# EAGLE design omnibus_proto (EAGLE 6.6.0)

## Sheet 1 of 2
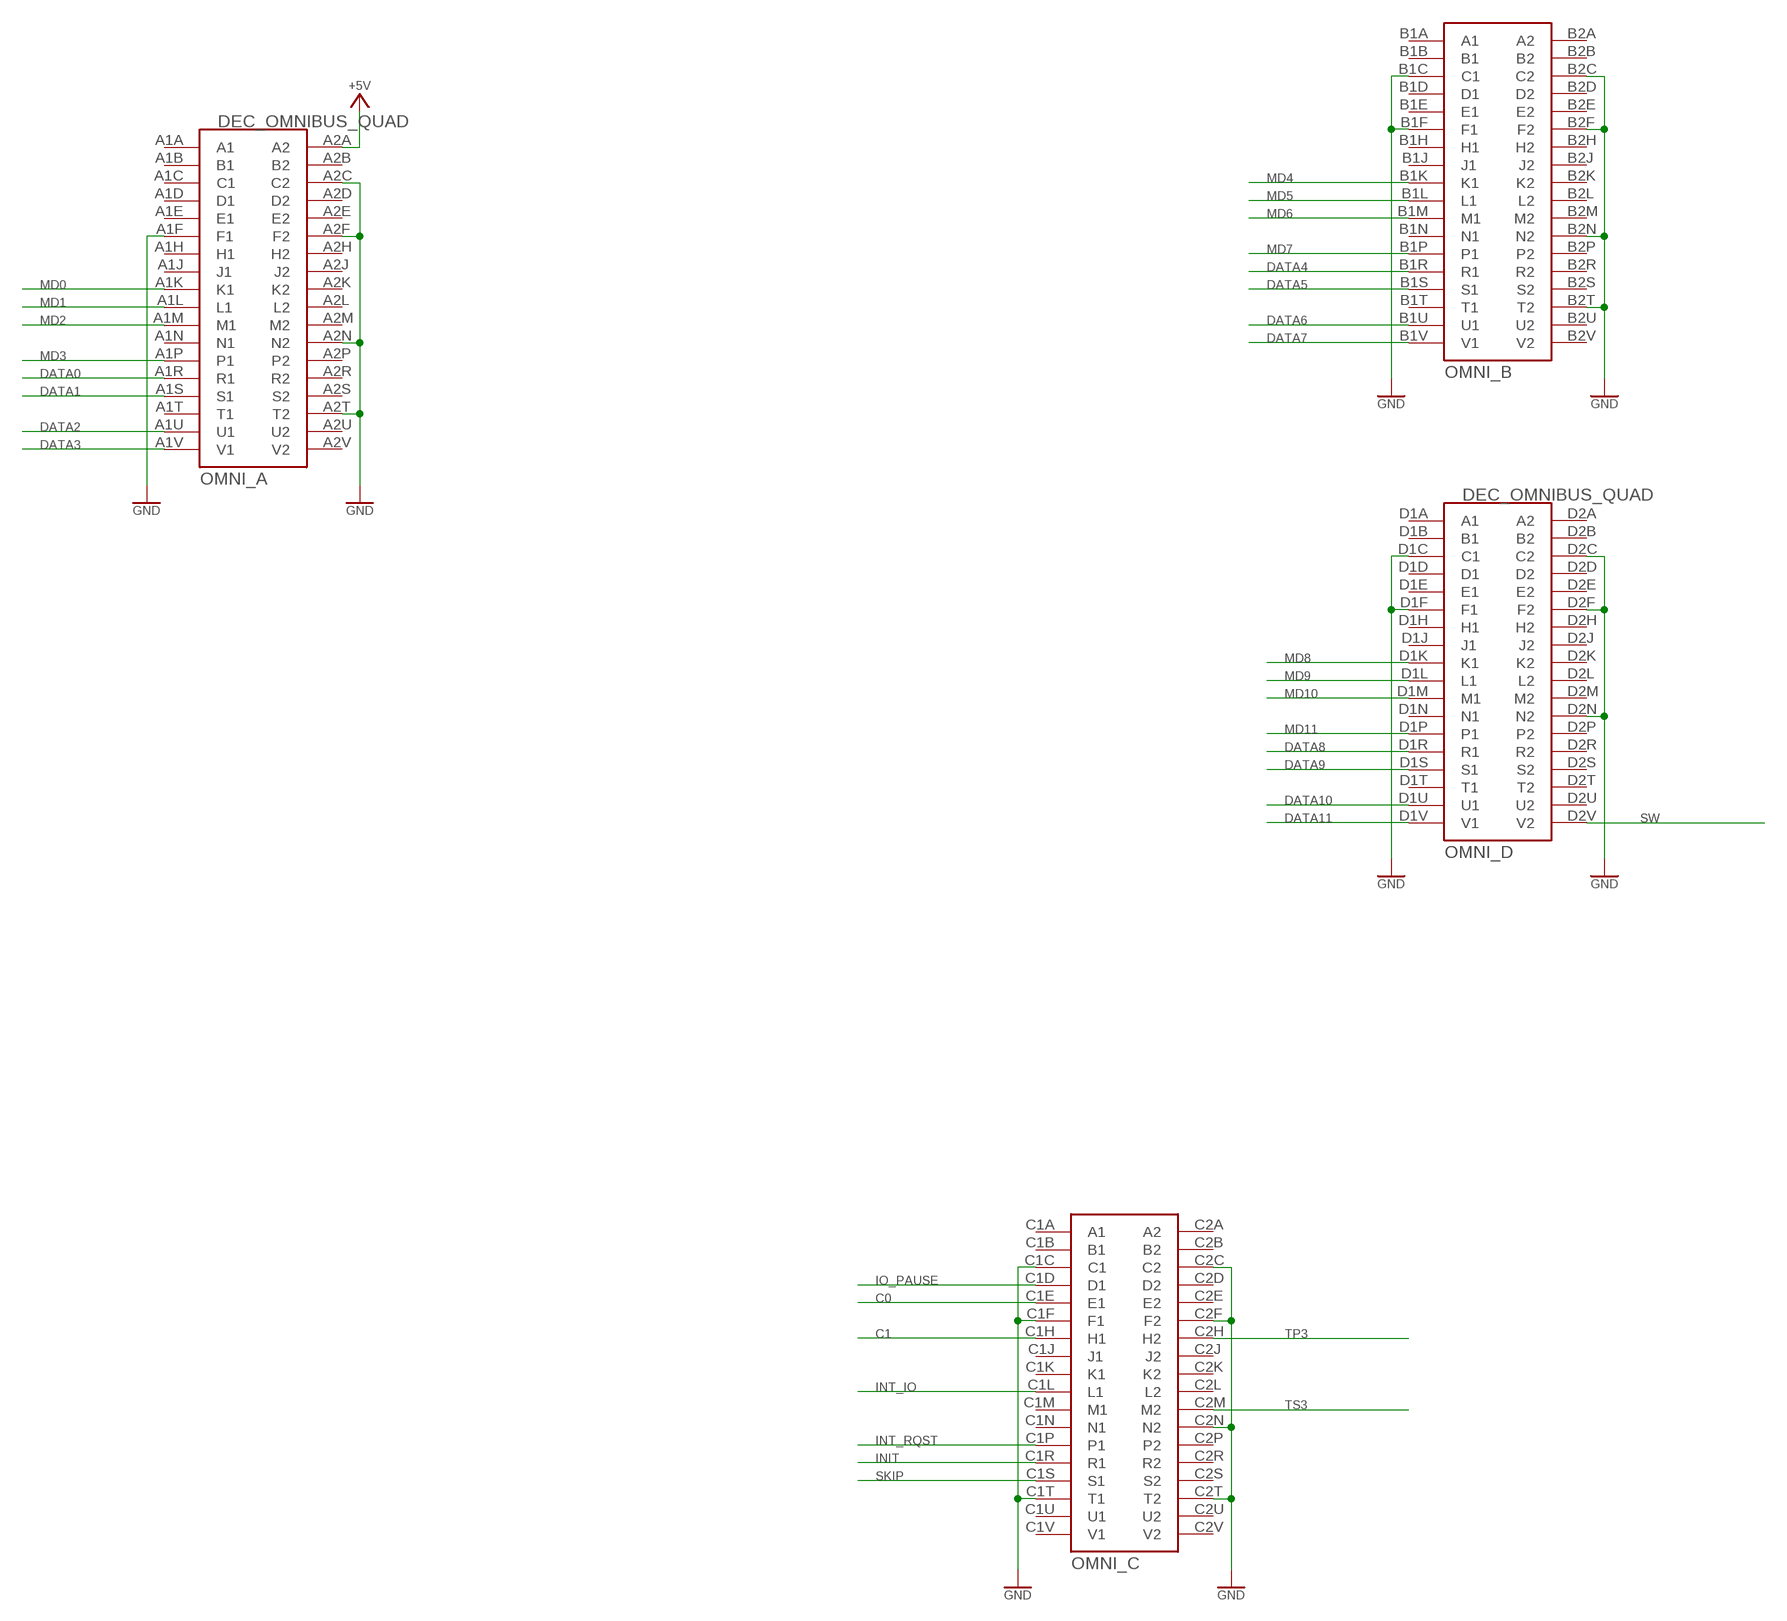
[diagram p0: schematic, sheet 1, part 1 of 2]
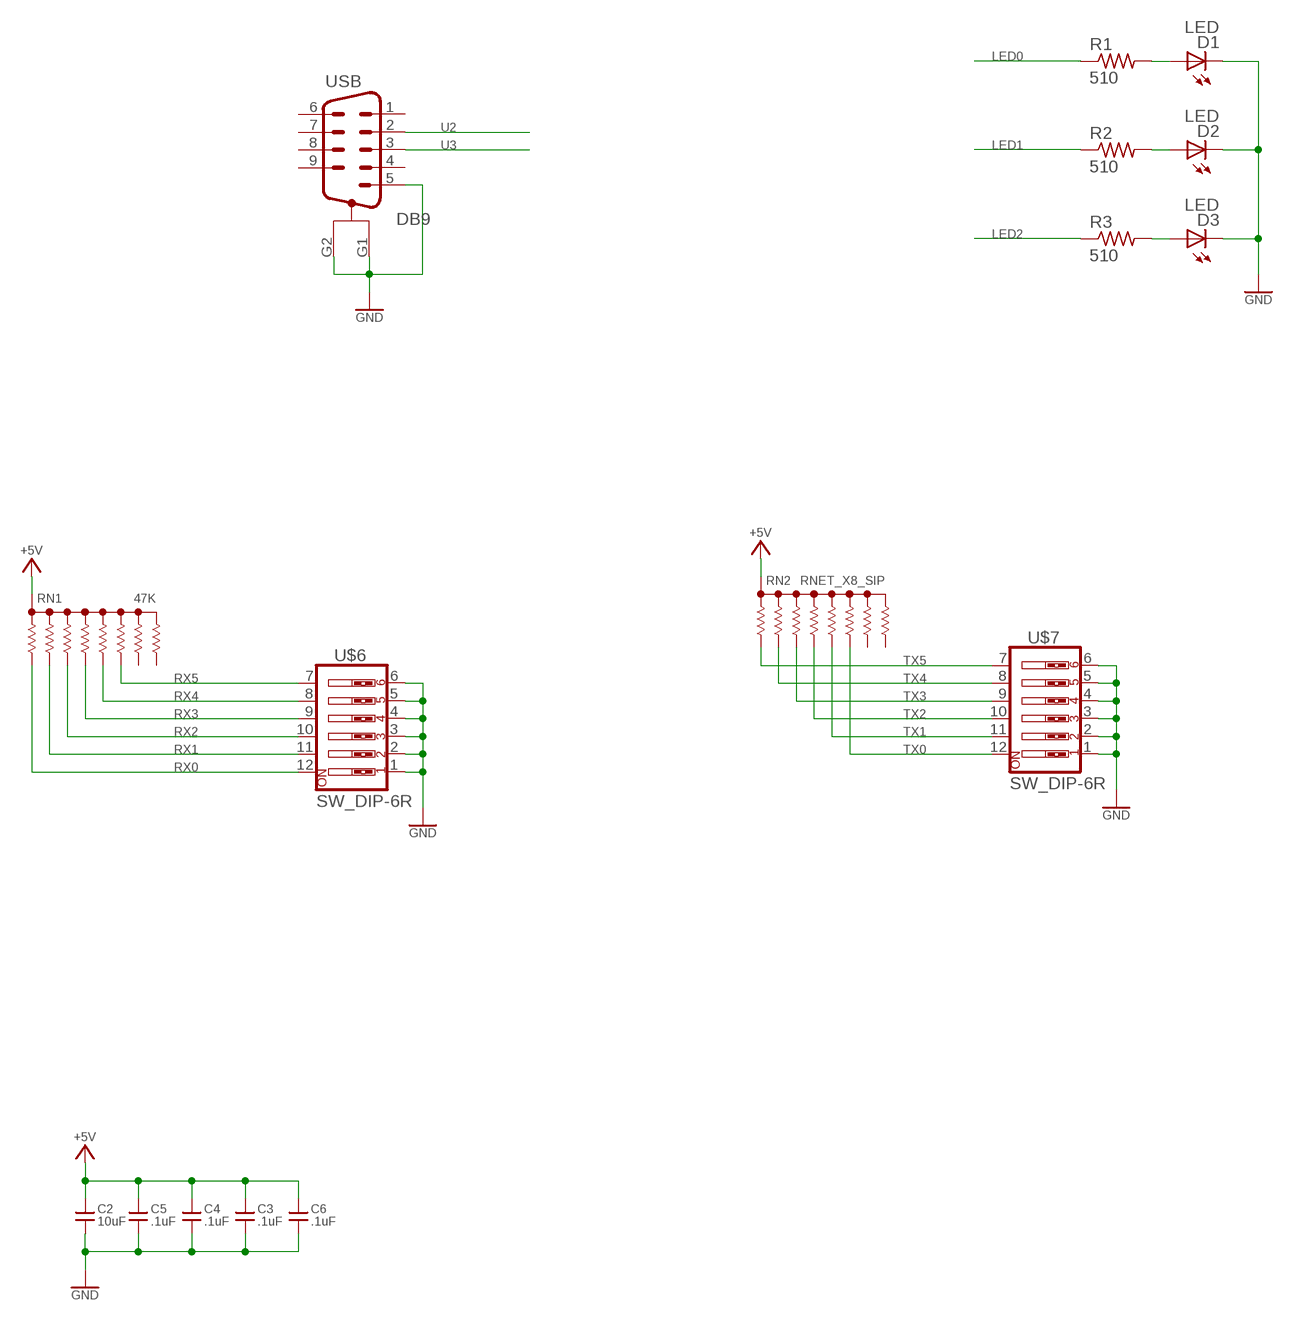
[diagram p1: schematic, sheet 1, part 2 of 2]

### Parts
C2  10uF  C_US  [C_TH_5MM]
C3  .1uF  C_US  [C_TH_5MM]
C4  .1uF  C_US  [C_TH_5MM]
C5  .1uF  C_US  [C_TH_5MM]
C6  .1uF  C_US  [C_TH_5MM]
D1  LED  [LED_TH_3MM]
D2  LED  [LED_TH_3MM]
D3  LED  [LED_TH_3MM]
OMNI  DEC_OMNIBUS_QUAD  [DEC_OMNIBUS_QUAD]
R1  510  R_US  [R_204/7]
R2  510  R_US  [R_204/7]
R3  510  R_US  [R_204/7]
RN1  47K  RNET_X8_SIP  [RN_SIP9]
RN2  RNET_X8_SIP  [RN_SIP9]
U$6  SW_DIP-6R  [SW_DIP-6_ROUND]
U$7  SW_DIP-6R  [SW_DIP-6_ROUND]
USB  DB9  [AMP_DB-9RA]

### Nets
+5V: C2.1 C3.1 C4.1 C5.1 C6.1 OMNI.A2A(_A:A2) RN1.1 RN2.1 ; also sheet 2
C0: OMNI.C1E(_C:E1) ; also sheet 2
C1: OMNI.C1H(_C:H1) ; also sheet 2
DATA0: OMNI.A1R(_A:R1) ; also sheet 2
DATA1: OMNI.A1S(_A:S1) ; also sheet 2
DATA2: OMNI.A1U(_A:U1) ; also sheet 2
DATA3: OMNI.A1V(_A:V1) ; also sheet 2
DATA4: OMNI.B1R(_B:R1) ; also sheet 2
DATA5: OMNI.B1S(_B:S1) ; also sheet 2
DATA6: OMNI.B1U(_B:U1) ; also sheet 2
DATA7: OMNI.B1V(_B:V1) ; also sheet 2
DATA8: OMNI.D1R(_D:R1) ; also sheet 2
DATA9: OMNI.D1S(_D:S1) ; also sheet 2
DATA10: OMNI.D1U(_D:U1) ; also sheet 2
DATA11: OMNI.D1V(_D:V1) ; also sheet 2
GND: C2.2 C3.2 C4.2 C5.2 C6.2 D1.K(C) D2.K(C) D3.K(C) OMNI.A1F(_A:F1) OMNI.A2C(_A:C2) OMNI.A2F(_A:F2) OMNI.A2N(_A:N2) OMNI.A2T(_A:T2) OMNI.B1C(_B:C1) OMNI.B1F(_B:F1) OMNI.B2C(_B:C2) OMNI.B2F(_B:F2) OMNI.B2N(_B:N2) OMNI.B2T(_B:T2) OMNI.C1C(_C:C1) OMNI.C1F(_C:F1) OMNI.C1T(_C:T1) OMNI.C2C(_C:C2) OMNI.C2F(_C:F2) OMNI.C2N(_C:N2) OMNI.C2T(_C:T2) OMNI.D1C(_D:C1) OMNI.D1F(_D:F1) OMNI.D2C(_D:C2) OMNI.D2F(_D:F2) OMNI.D2N(_D:N2) U$6.1 U$6.2 U$6.3 U$6.4 U$6.5 U$6.6 U$7.1 U$7.2 U$7.3 U$7.4 U$7.5 U$7.6 USB.5 USB.G1 USB.G2 ; also sheet 2
INIT: OMNI.C1R(_C:R1) ; also sheet 2
INT_IO: OMNI.C1L(_C:L1) ; also sheet 2
INT_RQST: OMNI.C1P(_C:P1) ; also sheet 2
IO_PAUSE: OMNI.C1D(_C:D1) ; also sheet 2
LED0: R1.1 ; also sheet 2
LED1: R2.1 ; also sheet 2
LED2: R3.1 ; also sheet 2
MD0: OMNI.A1K(_A:K1) ; also sheet 2
MD1: OMNI.A1L(_A:L1) ; also sheet 2
MD2: OMNI.A1M(_A:M1) ; also sheet 2
MD3: OMNI.A1P(_A:P1) ; also sheet 2
MD4: OMNI.B1K(_B:K1) ; also sheet 2
MD5: OMNI.B1L(_B:L1) ; also sheet 2
MD6: OMNI.B1M(_B:M1) ; also sheet 2
MD7: OMNI.B1P(_B:P1) ; also sheet 2
MD8: OMNI.D1K(_D:K1) ; also sheet 2
MD9: OMNI.D1L(_D:L1) ; also sheet 2
MD10: OMNI.D1M(_D:M1) ; also sheet 2
MD11: OMNI.D1P(_D:P1) ; also sheet 2
N$2: D3.A R3.2
N$3: D2.A R2.2
N$4: D1.A R1.2
RX0: RN1.2 U$6.12 ; also sheet 2
RX1: RN1.3 U$6.11 ; also sheet 2
RX2: RN1.4 U$6.10 ; also sheet 2
RX3: RN1.5 U$6.9 ; also sheet 2
RX4: RN1.6 U$6.8 ; also sheet 2
RX5: RN1.7 U$6.7 ; also sheet 2
SKIP: OMNI.C1S(_C:S1) ; also sheet 2
SW: OMNI.D2V(_D:V2) ; also sheet 2
TP3: OMNI.C2H(_C:H2) ; also sheet 2
TS3: OMNI.C2M(_C:M2) ; also sheet 2
TX0: RN2.7 U$7.12 ; also sheet 2
TX1: RN2.6 U$7.11 ; also sheet 2
TX2: RN2.5 U$7.10 ; also sheet 2
TX3: RN2.4 U$7.9 ; also sheet 2
TX4: RN2.3 U$7.8 ; also sheet 2
TX5: RN2.2 U$7.7 ; also sheet 2
U2: USB.2 ; also sheet 2
U3: USB.3 ; also sheet 2
Unconnected: OMNI.A1A(_A:A1) OMNI.A1B(_A:B1) OMNI.A1C(_A:C1) OMNI.A1D(_A:D1) OMNI.A1E(_A:E1) OMNI.A1H(_A:H1) OMNI.A1J(_A:J1) OMNI.A1N(_A:N1) OMNI.A1T(_A:T1) OMNI.A2B(_A:B2) OMNI.A2D(_A:D2) OMNI.A2E(_A:E2) OMNI.A2H(_A:H2) OMNI.A2J(_A:J2) OMNI.A2K(_A:K2) OMNI.A2L(_A:L2) OMNI.A2M(_A:M2) OMNI.A2P(_A:P2) OMNI.A2R(_A:R2) OMNI.A2S(_A:S2) OMNI.A2U(_A:U2) OMNI.A2V(_A:V2) OMNI.B1A(_B:A1) OMNI.B1B(_B:B1) OMNI.B1D(_B:D1) OMNI.B1E(_B:E1) OMNI.B1H(_B:H1) OMNI.B1J(_B:J1) OMNI.B1N(_B:N1) OMNI.B1T(_B:T1) OMNI.B2A(_B:A2) OMNI.B2B(_B:B2) OMNI.B2D(_B:D2) OMNI.B2E(_B:E2) OMNI.B2H(_B:H2) OMNI.B2J(_B:J2) OMNI.B2K(_B:K2) OMNI.B2L(_B:L2) OMNI.B2M(_B:M2) OMNI.B2P(_B:P2) OMNI.B2R(_B:R2) OMNI.B2S(_B:S2) OMNI.B2U(_B:U2) OMNI.B2V(_B:V2) OMNI.C1A(_C:A1) OMNI.C1B(_C:B1) OMNI.C1J(_C:J1) OMNI.C1K(_C:K1) OMNI.C1M(_C:M1) OMNI.C1N(_C:N1) OMNI.C1U(_C:U1) OMNI.C1V(_C:V1) OMNI.C2A(_C:A2) OMNI.C2B(_C:B2) OMNI.C2D(_C:D2) OMNI.C2E(_C:E2) OMNI.C2J(_C:J2) OMNI.C2K(_C:K2) OMNI.C2L(_C:L2) OMNI.C2P(_C:P2) OMNI.C2R(_C:R2) OMNI.C2S(_C:S2) OMNI.C2U(_C:U2) OMNI.C2V(_C:V2) OMNI.D1A(_D:A1) OMNI.D1B(_D:B1) OMNI.D1D(_D:D1) OMNI.D1E(_D:E1) OMNI.D1H(_D:H1) OMNI.D1J(_D:J1) OMNI.D1N(_D:N1) OMNI.D1T(_D:T1) OMNI.D2A(_D:A2) OMNI.D2B(_D:B2) OMNI.D2D(_D:D2) OMNI.D2E(_D:E2) OMNI.D2H(_D:H2) OMNI.D2J(_D:J2) OMNI.D2K(_D:K2) OMNI.D2L(_D:L2) OMNI.D2M(_D:M2) OMNI.D2P(_D:P2) OMNI.D2R(_D:R2) OMNI.D2S(_D:S2) OMNI.D2T(_D:T2) OMNI.D2U(_D:U2) RN1.8 RN1.9 RN2.8 RN2.9 USB.1 USB.4 USB.6 USB.7 USB.8 USB.9

## Sheet 2 of 2
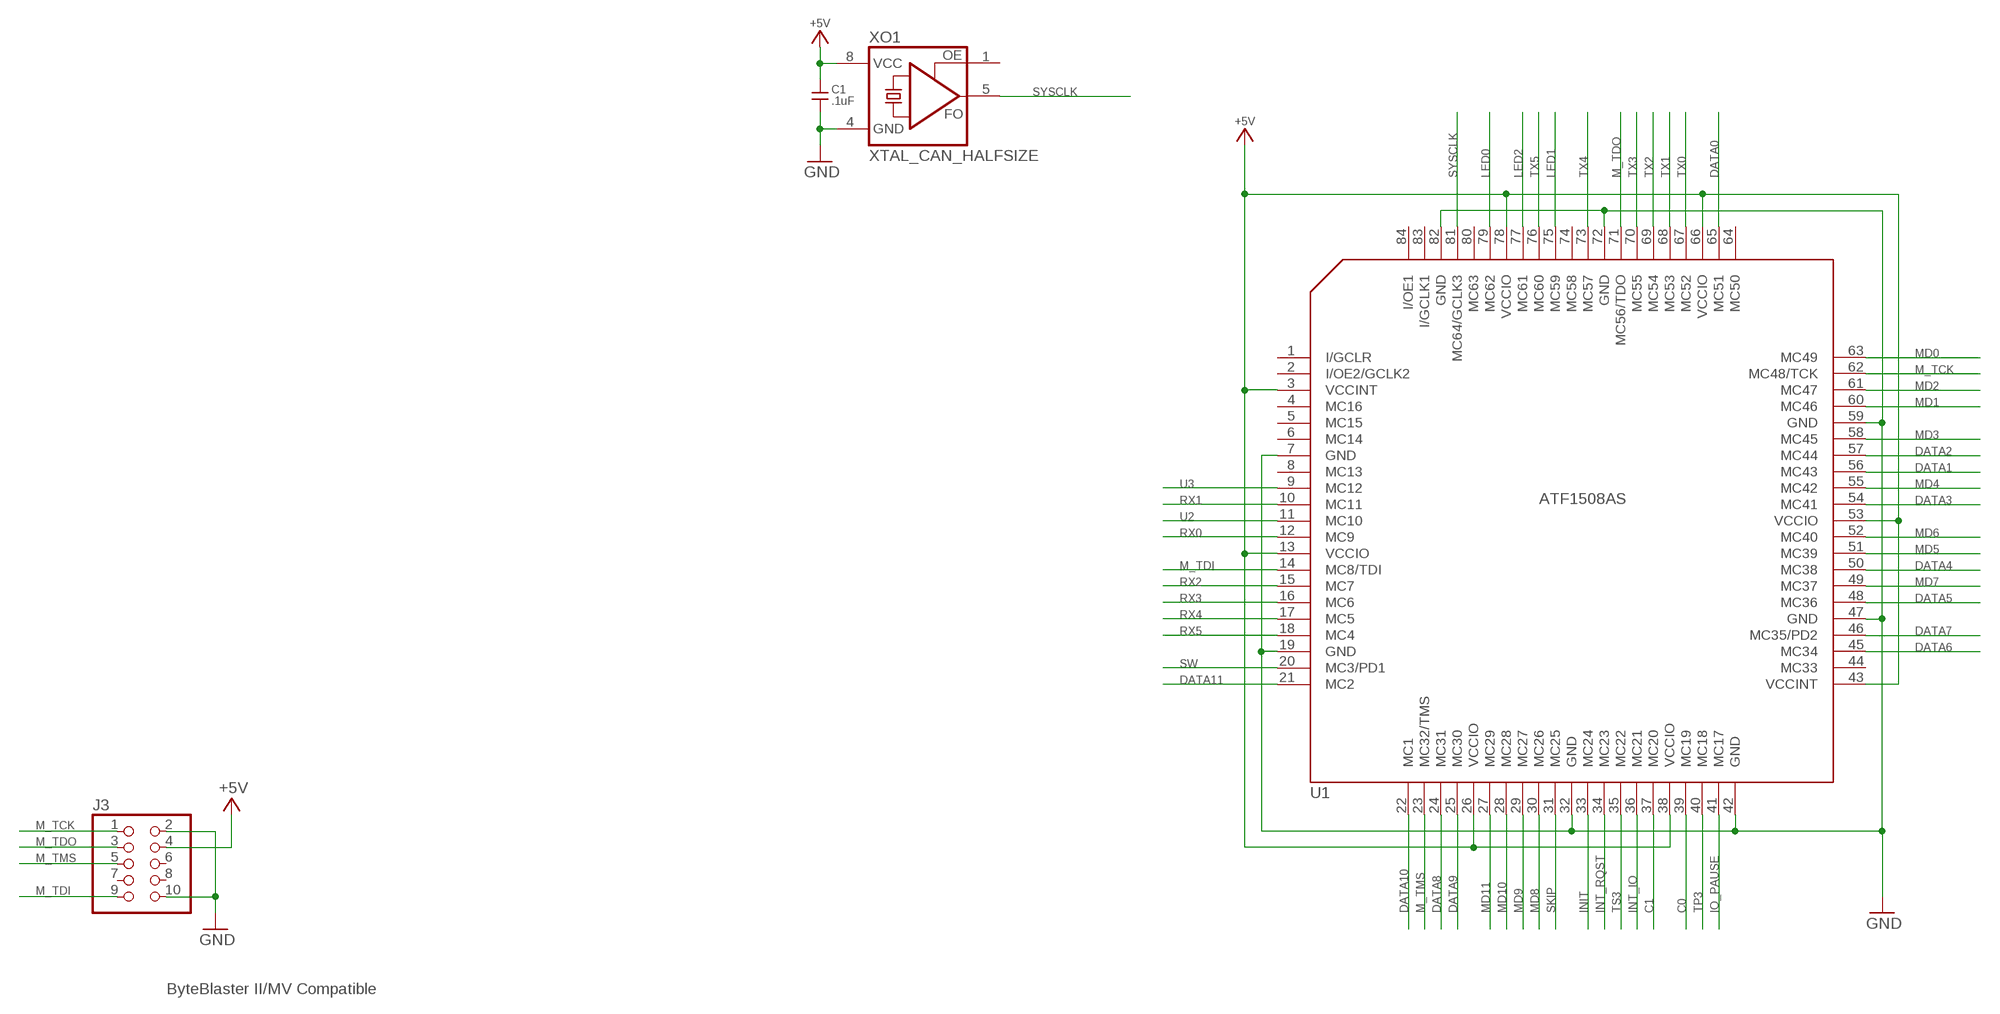
[diagram p2: schematic, sheet 2]

### Parts
C1  .1uF  C_US  [C_TH_5MM]
J3  HDR_2X5"  [HDR_2X5]
U1  ATF1508AS  ATF1504AS_PLCC  [PLCC84]
XO1  XTAL_CAN_HALFSIZE  [XTAL_CAN_HALFSIZE]

### Nets
+5V: C1.1 J3.4 U1.3(VCCINT) U1.13(VCCIO) U1.26(VCCIO) U1.38(VCCIO) U1.43(VCCINT) U1.53(VCCIO) U1.66(VCCIO) U1.78(VCCIO) XO1.8(VCC) ; also sheet 1
C0: U1.39(MC19) ; also sheet 1
C1: U1.37(MC20) ; also sheet 1
DATA0: U1.65(MC51) ; also sheet 1
DATA1: U1.56(MC43) ; also sheet 1
DATA2: U1.57(MC44) ; also sheet 1
DATA3: U1.54(MC41) ; also sheet 1
DATA4: U1.50(MC38) ; also sheet 1
DATA5: U1.48(MC36) ; also sheet 1
DATA6: U1.45(MC34) ; also sheet 1
DATA7: U1.46(MC35/PD2) ; also sheet 1
DATA8: U1.24(MC31) ; also sheet 1
DATA9: U1.25(MC30) ; also sheet 1
DATA10: U1.22(MC1) ; also sheet 1
DATA11: U1.21(MC2) ; also sheet 1
GND: C1.2 J3.2 J3.10 U1.7(GND) U1.19(GND) U1.32(GND) U1.42(GND) U1.47(GND) U1.59(GND) U1.72(GND) U1.82(GND) XO1.4(GND) ; also sheet 1
INIT: U1.33(MC24) ; also sheet 1
INT_IO: U1.36(MC21) ; also sheet 1
INT_RQST: U1.34(MC23) ; also sheet 1
IO_PAUSE: U1.41(MC17) ; also sheet 1
LED0: U1.79(MC62) ; also sheet 1
LED1: U1.75(MC59) ; also sheet 1
LED2: U1.77(MC61) ; also sheet 1
M_TCK: J3.1 U1.62(MC48/TCK)
M_TDI: J3.9 U1.14(MC8/TDI)
M_TDO: J3.3 U1.71(MC56/TDO)
M_TMS: J3.5 U1.23(MC32/TMS)
MD0: U1.63(MC49) ; also sheet 1
MD1: U1.60(MC46) ; also sheet 1
MD2: U1.61(MC47) ; also sheet 1
MD3: U1.58(MC45) ; also sheet 1
MD4: U1.55(MC42) ; also sheet 1
MD5: U1.51(MC39) ; also sheet 1
MD6: U1.52(MC40) ; also sheet 1
MD7: U1.49(MC37) ; also sheet 1
MD8: U1.30(MC26) ; also sheet 1
MD9: U1.29(MC27) ; also sheet 1
MD10: U1.28(MC28) ; also sheet 1
MD11: U1.27(MC29) ; also sheet 1
RX0: U1.12(MC9) ; also sheet 1
RX1: U1.10(MC11) ; also sheet 1
RX2: U1.15(MC7) ; also sheet 1
RX3: U1.16(MC6) ; also sheet 1
RX4: U1.17(MC5) ; also sheet 1
RX5: U1.18(MC4) ; also sheet 1
SKIP: U1.31(MC25) ; also sheet 1
SW: U1.20(MC3/PD1) ; also sheet 1
SYSCLK: U1.81(MC64/GCLK3) XO1.5(FO)
TP3: U1.40(MC18) ; also sheet 1
TS3: U1.35(MC22) ; also sheet 1
TX0: U1.67(MC52) ; also sheet 1
TX1: U1.68(MC53) ; also sheet 1
TX2: U1.69(MC54) ; also sheet 1
TX3: U1.70(MC55) ; also sheet 1
TX4: U1.73(MC57) ; also sheet 1
TX5: U1.76(MC60) ; also sheet 1
U2: U1.11(MC10) ; also sheet 1
U3: U1.9(MC12) ; also sheet 1
Unconnected: J3.6 J3.7 J3.8 U1.1(I/GCLR) U1.2(I/OE2/GCLK2) U1.4(MC16) U1.5(MC15) U1.6(MC14) U1.8(MC13) U1.44(MC33) U1.64(MC50) U1.74(MC58) U1.80(MC63) U1.83(I/GCLK1) U1.84(I/OE1) XO1.1(OE)

### Notes on the sheet
- ByteBlaster II/MV Compatible

## Library data of the parts
C1-C6 = alan_common:C_US: MLCC Ceramic cap
D1-D3 = alan_common:LED
J3 = alan_common:HDR_2X5: 0.254mm (100 mil) breakaway header - 2 x 5
OMNI = alan_common:DEC_OMNIBUS_QUAD
R1-R3 = alan_common:R_US
RN1 RN2 = alan_common:RNET_X8_SIP
U1 = alan_common:ATF1504AS: Atmel ATF1504 CPLD
U$6 U$7 = alan_common:SW_DIP-6
USB = alan_common:DB9; MANF: TE/AMP; MANF#: 1734352-1; MOUSER#: 571-1734352-1
XO1 = alan_common:XTAL_CAN_HALFSIZE

## Board
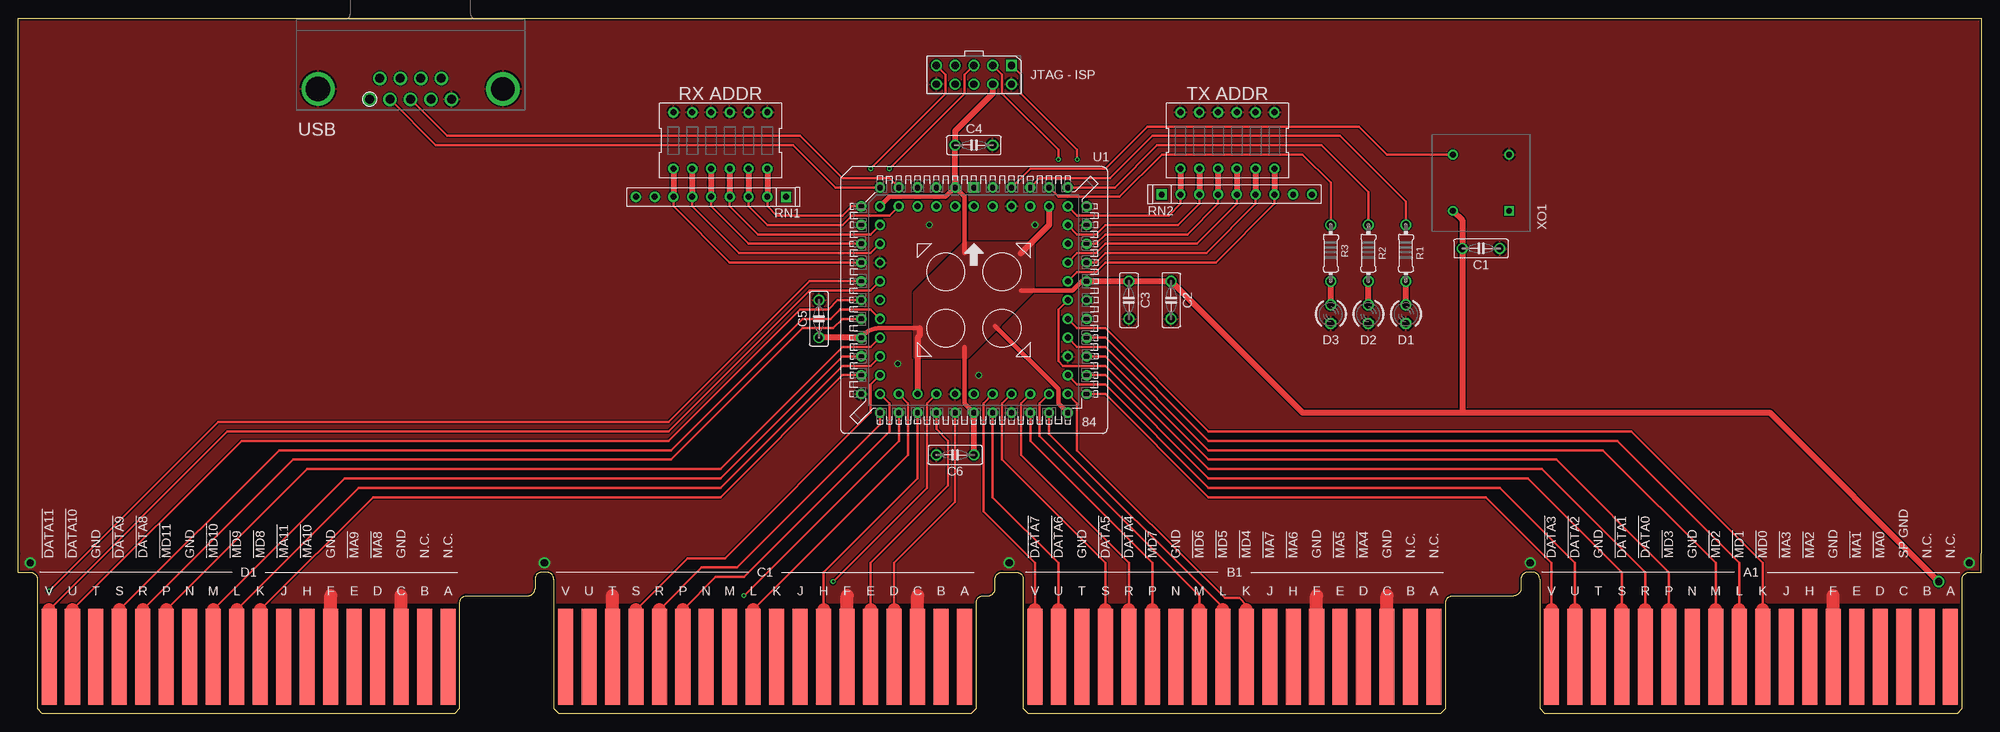
[diagram p3: board, top side]
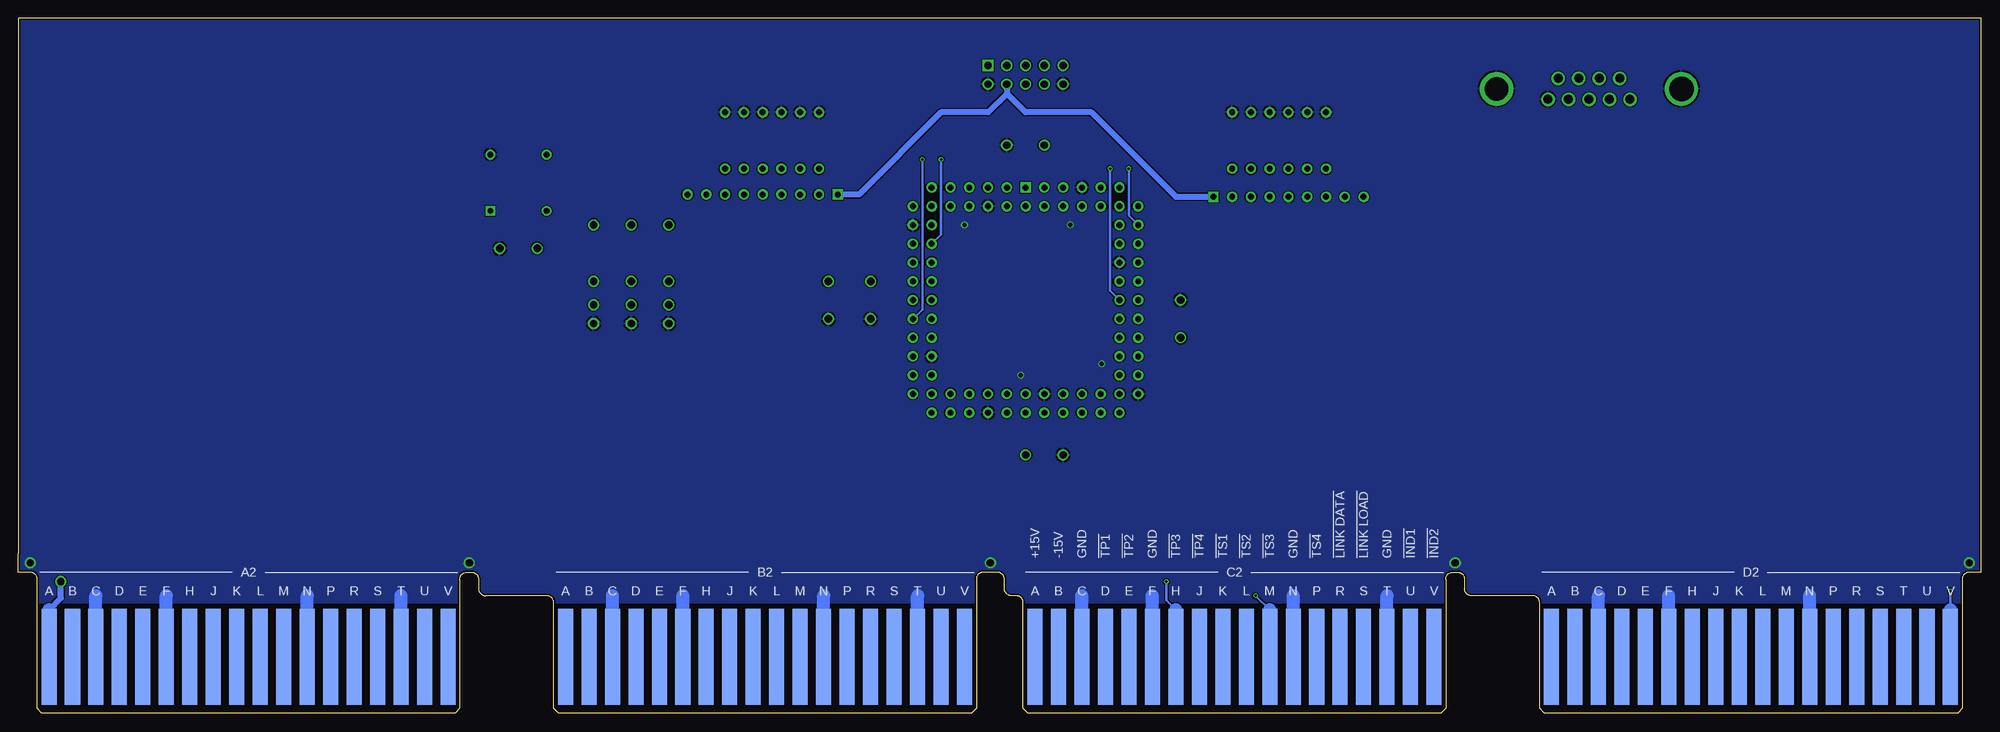
[diagram p4: board, bottom side, seen from below]

Size 265.43 x 93.98 mm. Coordinates in mm from the lower left corner, seen from the top.
Outline: 0,21.59 0,93.98 265.43,93.98 265.43,21.59
Copper layers (1*16): Top 0.035mm / dielectric 1.5mm / Bottom 0.035mm
Design rules "ITEADstudio_DRC": minimum track width 6mil, minimum drill 12mil, track to track 6mil, track to pad 6mil, pad to pad 6mil, via to via 6mil, smd to smd 0mil, copper to edge 10mil, drill to drill 10mil, minimum pad ring 10mil, minimum via ring 6mil, stop-mask expansion 2mil, vias tented up to drill 100mil, thermal gap 10mil

### Footprints (pad centres in the part's own frame; a part is rotated, then mirrored left to right if it is on the bottom)
C_TH_5MM = drill 1: 1 -2.54,0; 2 2.54,0
LED_TH_3MM = drill 1: A -1.27,0 | drill 1 octagon: K 1.27,0
HDR_2X5 = drill 1 square: 1 -5.08,-1.27 | drill 1: 2 -5.08,1.27; 3 -2.54,-1.27; 4 -2.54,1.27; 5 0,-1.27; 6 0,1.27; 7 2.54,-1.27; 8 2.54,1.27; 9 5.08,-1.27; 10 5.08,1.27
DEC_OMNIBUS_QUAD = smd 2.032 x 13.017: A1A 260.35,7.62; A1B 257.175,7.62; A1C 254,7.62; A1D 250.825,7.62; A1E 247.65,7.62; A1F 244.475,7.62; A1H 241.3,7.62; A1J 238.125,7.62; A1K 234.95,7.62; A1L 231.775,7.62; A1M 228.6,7.62; A1N 225.425,7.62; A1P 222.25,7.62; A1R 219.075,7.62; A1S 215.9,7.62; A1T 212.725,7.62; A1U 209.55,7.62; A1V 206.375,7.62; B1A 190.5,7.62; B1B 187.325,7.62; B1C 184.15,7.62; B1D 180.975,7.62; B1E 177.8,7.62; B1F 174.625,7.62; B1H 171.45,7.62; B1J 168.275,7.62; B1K 165.1,7.62; B1L 161.925,7.62; B1M 158.75,7.62; B1N 155.575,7.62; B1P 152.4,7.62; B1R 149.225,7.62; B1S 146.05,7.62; B1T 142.875,7.62; B1U 139.7,7.62; B1V 136.525,7.62; C1A 127,7.62; C1B 123.825,7.62; C1C 120.65,7.62; C1D 117.475,7.62; C1E 114.3,7.62; C1F 111.125,7.62; C1H 107.95,7.62; C1J 104.775,7.62; C1K 101.6,7.62; C1L 98.425,7.62; C1M 95.25,7.62; C1N 92.075,7.62; C1P 88.9,7.62; C1R 85.725,7.62; C1S 82.55,7.62; C1T 79.375,7.62; C1U 76.2,7.62; C1V 73.025,7.62; D1A 57.15,7.62; D1B 53.975,7.62; D1C 50.8,7.62; D1D 47.625,7.62; D1E 44.45,7.62; D1F 41.275,7.62; D1H 38.1,7.62; D1J 34.925,7.62; D1K 31.75,7.62; D1L 28.575,7.62; D1M 25.4,7.62; D1N 22.225,7.62; D1P 19.05,7.62; D1R 15.875,7.62; D1S 12.7,7.62; D1T 9.525,7.62; D1U 6.35,7.62; D1V 3.175,7.62 | smd 2.032 x 13.017 bottom: A2A 260.35,7.62; A2B 257.175,7.62; A2C 254,7.62; A2D 250.825,7.62; A2E 247.65,7.62; A2F 244.475,7.62; A2H 241.3,7.62; A2J 238.125,7.62; A2K 234.95,7.62; A2L 231.775,7.62; A2M 228.6,7.62; A2N 225.425,7.62; A2P 222.25,7.62; A2R 219.075,7.62; A2S 215.9,7.62; A2T 212.725,7.62; A2U 209.55,7.62; A2V 206.375,7.62; B2A 190.5,7.62; B2B 187.325,7.62; B2C 184.15,7.62; B2D 180.975,7.62; B2E 177.8,7.62; B2F 174.625,7.62; B2H 171.45,7.62; B2J 168.275,7.62; B2K 165.1,7.62; B2L 161.925,7.62; B2M 158.75,7.62; B2N 155.575,7.62; B2P 152.4,7.62; B2R 149.225,7.62; B2S 146.05,7.62; B2T 142.875,7.62; B2U 139.7,7.62; B2V 136.525,7.62; C2A 127,7.62; C2B 123.825,7.62; C2C 120.65,7.62; C2D 117.475,7.62; C2E 114.3,7.62; C2F 111.125,7.62; C2H 107.95,7.62; C2J 104.775,7.62; C2K 101.6,7.62; C2L 98.425,7.62; C2M 95.25,7.62; C2N 92.075,7.62; C2P 88.9,7.62; C2R 85.725,7.62; C2S 82.55,7.62; C2T 79.375,7.62; C2U 76.2,7.62; C2V 73.025,7.62; D2A 57.15,7.62; D2B 53.975,7.62; D2C 50.8,7.62; D2D 47.625,7.62; D2E 44.45,7.62; D2F 41.275,7.62; D2H 38.1,7.62; D2J 34.925,7.62; D2K 31.75,7.62; D2L 28.575,7.62; D2M 25.4,7.62; D2N 22.225,7.62; D2P 19.05,7.62; D2R 15.875,7.62; D2S 12.7,7.62; D2T 9.525,7.62; D2U 6.35,7.62; D2V 3.175,7.62
R_204/7 = drill 1: 1 -3.81,0; 2 3.81,0
RN_SIP9 = drill 0.8 pad 1.4 square: 1 -10.16,0 | drill 0.8 pad 1.4: 2 -7.62,0; 3 -5.08,0; 4 -2.54,0; 5 0,0; 6 2.54,0; 7 5.08,0; 8 7.62,0; 9 10.16,0
PLCC84 = drill 0.8 pad 1.4 square: 1 0,15.24 | drill 0.8 pad 1.4: 2 0,12.7; 3 -2.54,15.24; 4 -2.54,12.7; 5 -5.08,15.24; 6 -5.08,12.7; 7 -7.62,15.24; 8 -7.62,12.7; 9 -10.16,15.24; 10 -10.16,12.7; 11 -12.7,15.24; 12 -15.24,12.7; 13 -12.7,12.7; 14 -15.24,10.16; 15 -12.7,10.16; 16 -15.24,7.62; 17 -12.7,7.62; 18 -15.24,5.08; 19 -12.7,5.08; 20 -15.24,2.54; 21 -12.7,2.54; 22 -15.24,0; 23 -12.7,0; 24 -15.24,-2.54; 25 -12.7,-2.54; 26 -15.24,-5.08; 27 -12.7,-5.08; 28 -15.24,-7.62; 29 -12.7,-7.62; 30 -15.24,-10.16; 31 -12.7,-10.16; 32 -15.24,-12.7; 33 -12.7,-15.24; 34 -12.7,-12.7; 35 -10.16,-15.24; 36 -10.16,-12.7; 37 -7.62,-15.24; 38 -7.62,-12.7; 39 -5.08,-15.24; 40 -5.08,-12.7; 41 -2.54,-15.24; 42 -2.54,-12.7; 43 0,-15.24; 44 0,-12.7; 45 2.54,-15.24; 46 2.54,-12.7; 47 5.08,-15.24; 48 5.08,-12.7; 49 7.62,-15.24; 50 7.62,-12.7; 51 10.16,-15.24; 52 10.16,-12.7; 53 12.7,-15.24; 54 15.24,-12.7; 55 12.7,-12.7; 56 15.24,-10.16; 57 12.7,-10.16; 58 15.24,-7.62; 59 12.7,-7.62; 60 15.24,-5.08; 61 12.7,-5.08; 62 15.24,-2.54; 63 12.7,-2.54; 64 15.24,0; 65 12.7,0; 66 15.24,2.54; 67 12.7,2.54; 68 15.24,5.08; 69 12.7,5.08; 70 15.24,7.62; 71 12.7,7.62; 72 15.24,10.16; 73 12.7,10.16; 74 15.24,12.7; 75 12.7,15.24; 76 12.7,12.7; 77 10.16,15.24; 78 10.16,12.7; 79 7.62,15.24; 80 7.62,12.7; 81 5.08,15.24; 82 5.08,12.7; 83 2.54,15.24; 84 2.54,12.7
SW_DIP-6_ROUND = drill 0.8 pad 1.4: 1 -6.35,-3.81; 2 -3.81,-3.81; 3 -1.27,-3.81; 4 1.27,-3.81; 5 3.81,-3.81; 6 6.35,-3.81; 7 6.35,3.81; 8 3.81,3.81; 9 1.27,3.81; 10 -1.27,3.81; 11 -3.81,3.81; 12 -6.35,3.81
AMP_DB-9RA = drill 1.2: 1 -5.54,-1.42; 2 -2.77,-1.42; 3 0,-1.42; 4 2.77,-1.42; 5 5.54,-1.42; 6 -4.155,1.42; 7 -1.385,1.42; 8 1.385,1.42; 9 4.155,1.42 | drill 3.302 pad 4.5: G1 -12.5,0 | drill 3.18 pad 4.5: G2 12.5,0
XTAL_CAN_HALFSIZE = drill 0.8 square: 1 -3.81,-3.81 | drill 0.8: 4 3.81,-3.81; 5 3.81,3.81; 8 -3.81,3.81

### Placement (x,y rotation side)
C1  197.8,62.87 0 top
C2  155.89,55.88 270 top
C3  150.18,55.88 270 top
C4  129.22,76.83 0 top
C5  108.27,53.34 90 top
C6  126.68,34.92 180 top
D1  187.64,53.98 270 top
D2  182.56,53.98 270 top
D3  177.48,53.98 270 top
J3  129.22,86.36 180 top
OMNI  0.95,0 0 top
R1  187.64,62.23 270 top
R2  182.56,62.23 270 top
R3  177.48,62.23 270 top
RN1  93.66,69.85 180 top
RN2  164.78,70.17 0 top
U1  129.22,55.88 0 top
U$6  94.93,77.47 180 top
U$7  163.51,77.47 180 top
USB  53.02,84.45 0 top
XO1  197.8,71.75 90 top

### Tracks (layer width: path | path; a pad name or v marks a point on that pad's centre or on a via)
+5V  (via drill 1)
  Top 0.61: U1.13 117.79,69.85 125.41,69.85 U1.3 127.95,69.85 127.95,62.23 | U1.43 127.95,41.91 127.95,49.53 | U1.26 114.53,51.34 arc-45 116.28,52.07 121.92,52.07 | 135.57,57.15 142.56,57.15 143.83,58.42 U1.66 | U1.53 140.65,41.91 140.65,43.81 132.08,52.39
  Top 0.813: U1.78 139.38,66.04 135.57,62.23 | U1.38 121.6,50.8 121.92,51.12 121.92,52.07 | U1.3 C4.1 126.68,78.74 131.76,83.82 J3.4 | U1.66 C3.1 C2.1 173.67,40.64 195.26,40.64 | C6.1 U1.43 | U1.26 C5.1 | XO1.8 195.26,66.67 C1.1 195.26,40.64 | 195.26,40.64 236.86,40.64 v259.71,17.78
  Bottom 0.813: J3.4 131.76,83.82 | 131.76,83.82 129.22,81.28 120.33,81.28 108.9,69.85 RN1.1 | 131.76,83.82 134.3,81.28 140.65,81.28 151.76,70.17 RN2.1 | 261.3,13.97 259.71,15.56 v259.71,17.78
  Bottom 1.778: OMNI.A2A 261.3,13.97
  pour Top: 137.16,63.5 127.95,63.5 121.28,56.83 121.28,48.26 128.27,48.26 137.16,57.15
C0
  Top 0.305: 115.25,13.97 115.25,20.32 125.73,30.8 125.73,36.83 124.14,38.42 U1.39
  Top 1.778: OMNI.C1E 115.25,13.97
C1
  Top 0.305: 108.9,13.97 108.9,19.05 121.6,31.75 U1.37
  Top 1.778: OMNI.C1H 108.9,13.97
DATA0
  Top 0.305: 220.03,13.97 220.03,19.05 206.06,33.02 160.97,33.02 147,46.99 141.29,46.99 140.65,47.62 140.65,54.61 U1.65
  Top 1.778: OMNI.A1R 220.03,13.97
DATA1
  Top 0.305: 216.85,13.97 216.85,19.05 204.15,31.75 160.97,31.75 147,45.72 U1.56
  Top 1.778: OMNI.A1S 216.85,13.97
DATA2
  Top 0.305: 210.5,13.97 210.5,20.32 200.34,30.48 160.97,30.48 147,44.45 143.19,44.45 U1.57
  Top 1.778: OMNI.A1U 210.5,13.97
DATA3
  Top 0.305: 207.33,13.97 207.33,20.32 198.44,29.21 160.97,29.21 147,43.18 U1.54
  Top 1.778: OMNI.A1V 207.33,13.97
DATA4
  Top 0.305: 150.18,13.97 150.18,20.32 135.57,34.92 135.57,41.91 U1.50
  Top 1.778: OMNI.B1R 150.18,13.97
DATA5
  Top 0.305: 147,13.97 147,20.32 133.03,34.29 133.03,41.91 U1.48
  Top 1.778: OMNI.B1S 147,13.97
DATA6
  Top 0.305: 140.65,13.97 140.65,20.32 131.76,29.21 U1.45
  Top 1.778: OMNI.B1U 140.65,13.97
DATA7
  Top 0.305: 137.48,13.97 137.48,20.32 130.49,27.3 130.49,41.91 U1.46
  Top 1.778: OMNI.B1V 137.48,13.97
DATA8
  Top 0.305: 16.83,13.97 37.15,34.29 88.26,34.29 106.05,52.07 110.17,52.07 111.44,53.34 U1.24
  Top 1.778: OMNI.D1R 16.83,13.97
DATA9
  Top 0.305: 13.65,13.97 35.24,35.56 88.26,35.56 106.05,53.34 109.86,53.34 111.12,54.61 115.25,54.61 U1.25
  Top 1.778: OMNI.D1S 13.65,13.97
DATA10
  Top 0.305: 7.3,13.97 30.16,36.83 87.95,36.83 105.73,54.61 109.54,54.61 110.81,55.88 U1.22
  Top 1.778: OMNI.D1U 7.3,13.97
DATA11
  Top 0.305: 4.13,13.97 28.26,38.1 87.95,38.1 107,57.15 115.25,57.15 U1.21
  Top 1.778: OMNI.D1V 4.13,13.97
GND  (via drill 0.6, 1)
  Top 1.778: OMNI.D2F 42.23,15.88 | OMNI.D2C 51.75,15.88 | OMNI.C2T 80.33,15.88 | OMNI.C2F 112.08,15.88 | OMNI.C2C 121.6,15.88 | OMNI.A2F 245.43,15.88 | OMNI.B2F 175.58,15.88 | OMNI.B2C 185.1,15.88
  Bottom 1.778: OMNI.C2T 80.33,15.88 | OMNI.C2N 93.03,15.88 | OMNI.C2F 112.08,15.88 | OMNI.C2C 121.6,15.88 | OMNI.D2N 23.18,15.88 | OMNI.D2F 42.23,15.88 | OMNI.D2C 51.75,15.88 | OMNI.A2F 245.43,15.88 | OMNI.B2C 185.1,15.88 | OMNI.B2F 175.58,15.88 | OMNI.B2N 156.53,15.88 | OMNI.B2T 143.83,15.88 | OMNI.A2C 254.95,15.88 | OMNI.A2T 213.68,15.88 | OMNI.A2N 226.38,15.88
  other vias: 137.48,66.04 123.19,66.04 118.9,47.25 129.86,45.72 1.59,20.32 71.12,20.32 133.98,20.32 204.47,20.32 263.84,20.32
  pour Top (rank 6): 2.54,14.92 2.54,18.1 arc90 1.59,19.05 0,19.05 0,93.98 265.43,93.98 265.43,19.05 263.84,19.05 arc90 262.89,18.1 262.89,14.92 205.74,14.92 205.74,18.1 arc90 204.79,19.05 204.15,19.05 arc90 203.2,18.1 203.2,16.83 arc-90 202.25,15.88 193.99,15.88 arc90 193.04,14.92 135.89,14.92 135.89,18.1 arc90 134.94,19.05 133.03,19.05 arc90 132.08,18.1 132.08,16.83 arc-90 131.13,15.88 130.49,15.88 arc90 129.54,14.92 72.39,14.92 72.39,18.1 arc90 71.44,19.05 70.8,19.05 arc90 69.85,18.1 69.85,16.83 arc-90 68.9,15.88 60.64,15.88 arc90 59.69,14.92
  pour Bottom (rank 6): 2.54,14.92 59.69,14.92 arc-90 60.64,15.88 68.9,15.88 arc90 69.85,16.83 69.85,18.1 arc-90 70.8,19.05 71.44,19.05 arc-90 72.39,18.1 72.39,14.92 129.54,14.92 arc-90 130.49,15.88 131.13,15.88 arc90 132.08,16.83 132.08,18.1 arc-90 133.03,19.05 134.94,19.05 arc-90 135.89,18.1 135.89,14.92 193.04,14.92 arc-90 193.99,15.88 202.25,15.88 arc90 203.2,16.83 203.2,18.1 arc-90 204.15,19.05 204.79,19.05 arc-90 205.74,18.1 205.74,14.92 262.89,14.92 262.89,18.1 arc-90 263.84,19.05 265.43,19.05 265.43,93.98 0,93.98 0,19.05 1.59,19.05 arc-90 2.54,18.1
INIT
  Top 0.305: U1.33 116.52,39.05 97.16,19.68 92.39,19.68 86.68,13.97
  Top 1.778: OMNI.C1R 86.68,13.97
INT_IO
  Top 0.305: 99.38,13.97 120.33,34.92 120.33,39.37 120.33,40.01 120.33,41.91 U1.36
  Top 1.778: OMNI.C1L 99.38,13.97
INT_RQST
  Top 0.305: U1.34 117.79,41.91 117.79,38.1 98.11,18.41 94.3,18.41 89.85,13.97
  Top 1.778: OMNI.C1P 89.85,13.97
IO_PAUSE
  Top 0.305: 118.43,13.97 118.43,20.32 126.68,28.57 U1.41
  Top 1.778: OMNI.C1D 118.43,13.97
LED0
  Top 0.305: U1.79 138.11,72.39 147.64,72.39 153.35,78.11 178.75,78.11 187.64,69.22 R1.1
LED1
  Top 0.305: U1.75 148.27,71.12 153.99,76.83 176.21,76.83 182.56,70.48 R2.1
LED2
  Top 0.305: U1.77 140.65,69.85 148.91,69.85 154.62,75.56 173.67,75.56 177.48,71.75 R3.1
M_TCK  (via drill 0.33)
  Top 0.305: J3.1 135.57,86.36 135.57,83.82 143.19,76.2 v143.19,74.93
  Bottom 0.305: U1.62 143.19,54.61 v143.19,74.93
M_TDI  (via drill 0.33)
  Top 0.305: J3.9 125.41,86.36 125.41,83.82 v115.25,73.66
  Bottom 0.305: U1.14 115.25,67.31 v115.25,73.66
M_TDO  (via drill 0.33)
  Top 0.305: J3.3 133.03,86.36 133.03,83.82 140.65,76.2 v140.65,74.93
  Bottom 0.305: U1.71 140.65,64.77 v140.65,74.93
M_TMS  (via drill 0.33)
  Top 0.305: J3.5 127.95,86.36 127.95,83.82 v117.79,73.66
  Bottom 0.305: U1.23 117.79,57.15 v117.79,73.66
MD0
  Top 0.305: 235.9,13.97 235.9,20.32 218.12,38.1 160.97,38.1 147,52.07 143.19,52.07 U1.63
  Top 1.778: OMNI.A1K 235.9,13.97
MD1
  Top 0.305: 232.73,13.97 232.73,20.32 216.22,36.83 160.97,36.83 147,50.8 U1.60
  Top 1.778: OMNI.A1L 232.73,13.97
MD2
  Top 0.305: 229.55,13.97 229.55,20.32 214.31,35.56 160.97,35.56 147,49.53 143.19,49.53 U1.61
  Top 1.778: OMNI.A1M 229.55,13.97
MD3
  Top 0.305: 223.2,13.97 223.2,19.05 207.96,34.29 160.97,34.29 147,48.26 U1.58
  Top 1.778: OMNI.A1P 223.2,13.97
MD4
  Top 0.305: U1.55 143.19,41.91 143.19,35.56 163.2,15.56 165.1,15.56 166.05,14.61 166.05,13.97
  Top 1.778: OMNI.B1K 166.05,13.97
MD5
  Top 0.305: U1.51 139.38,37.78 162.88,14.29 162.88,13.97
  Top 1.778: OMNI.B1L 162.88,13.97
MD6
  Top 0.305: U1.52 138.11,41.91 138.11,37.47 159.7,15.88 159.7,13.97
  Top 1.778: OMNI.B1M 159.7,13.97
MD7
  Top 0.305: 153.35,13.97 153.35,20.32 136.84,36.83 U1.49
  Top 1.778: OMNI.B1P 153.35,13.97
MD8
  Top 0.305: 32.7,13.97 47.94,29.21 94.93,29.21 111.44,45.72 U1.30
  Top 1.778: OMNI.D1K 32.7,13.97
MD9
  Top 0.305: 29.53,13.97 46.04,30.48 94.93,30.48 111.44,46.99 115.25,46.99 U1.29
  Top 1.778: OMNI.D1L 29.53,13.97
MD10
  Top 0.305: 26.35,13.97 44.13,31.75 94.93,31.75 111.44,48.26 U1.28
  Top 1.778: OMNI.D1M 26.35,13.97
MD11
  Top 0.305: 20,13.97 39.05,33.02 94.93,33.02 111.44,49.53 112.71,49.53 113.03,49.53 115.25,49.53 U1.27
  Top 1.778: OMNI.D1P 20,13.97
N$2
  Top 0.813: D3.A R3.2
N$3
  Top 0.813: D2.A R2.2
N$4
  Top 0.813: D1.A R1.2
RX0
  Top 0.305: U1.12 112.71,68.58 111.44,67.31 102.55,67.31 101.28,68.58 RN1.2
  Top 0.813: U$6.12 RN1.2
RX1
  Top 0.305: U1.10 117.79,67.31 112.71,67.31 111.44,66.04 101.28,66.04 98.74,68.58 RN1.3
  Top 0.813: U$6.11 RN1.3
RX2
  Top 0.305: U1.15 115.25,64.77 100.01,64.77 96.2,68.58 RN1.4
  Top 0.813: U$6.10 RN1.4
RX3
  Top 0.305: U1.16 98.74,63.5 93.66,68.58 RN1.5
  Top 0.813: U$6.9 RN1.5
RX4
  Top 0.305: U1.17 115.25,62.23 97.47,62.23 91.12,68.58 RN1.6
  Top 0.813: U$6.8 RN1.6
RX5
  Top 0.305: U1.18 96.2,60.96 88.58,68.58 RN1.7
  Top 0.813: U$6.7 RN1.7
SKIP
  Top 0.305: U1.31 115.25,44.45 115.25,40.64 95.57,20.95 90.49,20.95 83.5,13.97
  Top 1.778: OMNI.C1S 83.5,13.97
SW  (via drill 0.33)
  Top 0.305: v4.13,16.51 26.99,39.37 87.95,39.37 107,58.42 U1.20
  Bottom 0.305: 4.13,13.97 v4.13,16.51
  Bottom 1.778: OMNI.D2V 4.13,13.97
SYSCLK
  Top 0.305: U1.81 136.84,73.66 147,73.66 152.72,79.38 181.29,79.38 185.1,75.56 XO1.5
TP3  (via drill 0.33)
  Top 0.305: v110.17,17.78 122.87,30.48 122.87,41.91 U1.40
  Bottom 0.305: 108.9,13.97 110.17,15.24 v110.17,17.78
  Bottom 1.778: OMNI.C2H 108.9,13.97
TS3  (via drill 0.33)
  Top 0.305: v98.11,15.88 119.06,36.83 U1.35
  Bottom 0.305: 96.2,13.97 v98.11,15.88
  Bottom 1.778: OMNI.C2M 96.2,13.97
TX0
  Top 0.305: U1.67 143.19,59.69 145.73,59.69 147,60.96 161.92,60.96 169.86,68.9 RN2.7
  Top 0.813: U$7.12 RN2.7
TX1
  Top 0.305: U1.68 145.73,60.96 147,62.23 160.65,62.23 167.32,68.9 RN2.6
  Top 0.813: U$7.11 RN2.6
TX2
  Top 0.305: U1.69 143.19,62.23 145.73,62.23 147,63.5 159.39,63.5 164.78,68.9 RN2.5
  Top 0.813: U$7.10 RN2.5
TX3
  Top 0.305: U1.70 145.73,63.5 147,64.77 158.11,64.77 162.24,68.9 RN2.4
  Top 0.813: U$7.9 RN2.4
TX4
  Top 0.305: U1.73 143.19,64.77 145.73,64.77 147,66.04 156.85,66.04 159.7,68.9 RN2.3
  Top 0.813: U$7.8 RN2.3
TX5
  Top 0.305: U1.76 143.19,67.31 155.58,67.31 157.16,68.9 RN2.2
  Top 0.813: U$7.7 RN2.2
U2
  Top 0.305: U1.11 110.49,71.12 104.78,76.83 56.45,76.83 USB.2
U3
  Top 0.305: U1.9 117.79,72.39 111.44,72.39 105.73,78.11 57.95,78.11 USB.3

### Text on the board
tPlace: JTAG - ISP | RX ADDR | TX ADDR